# Altium schematic sheet 2022 PD Board.SchDoc
size 254 x 381 mm
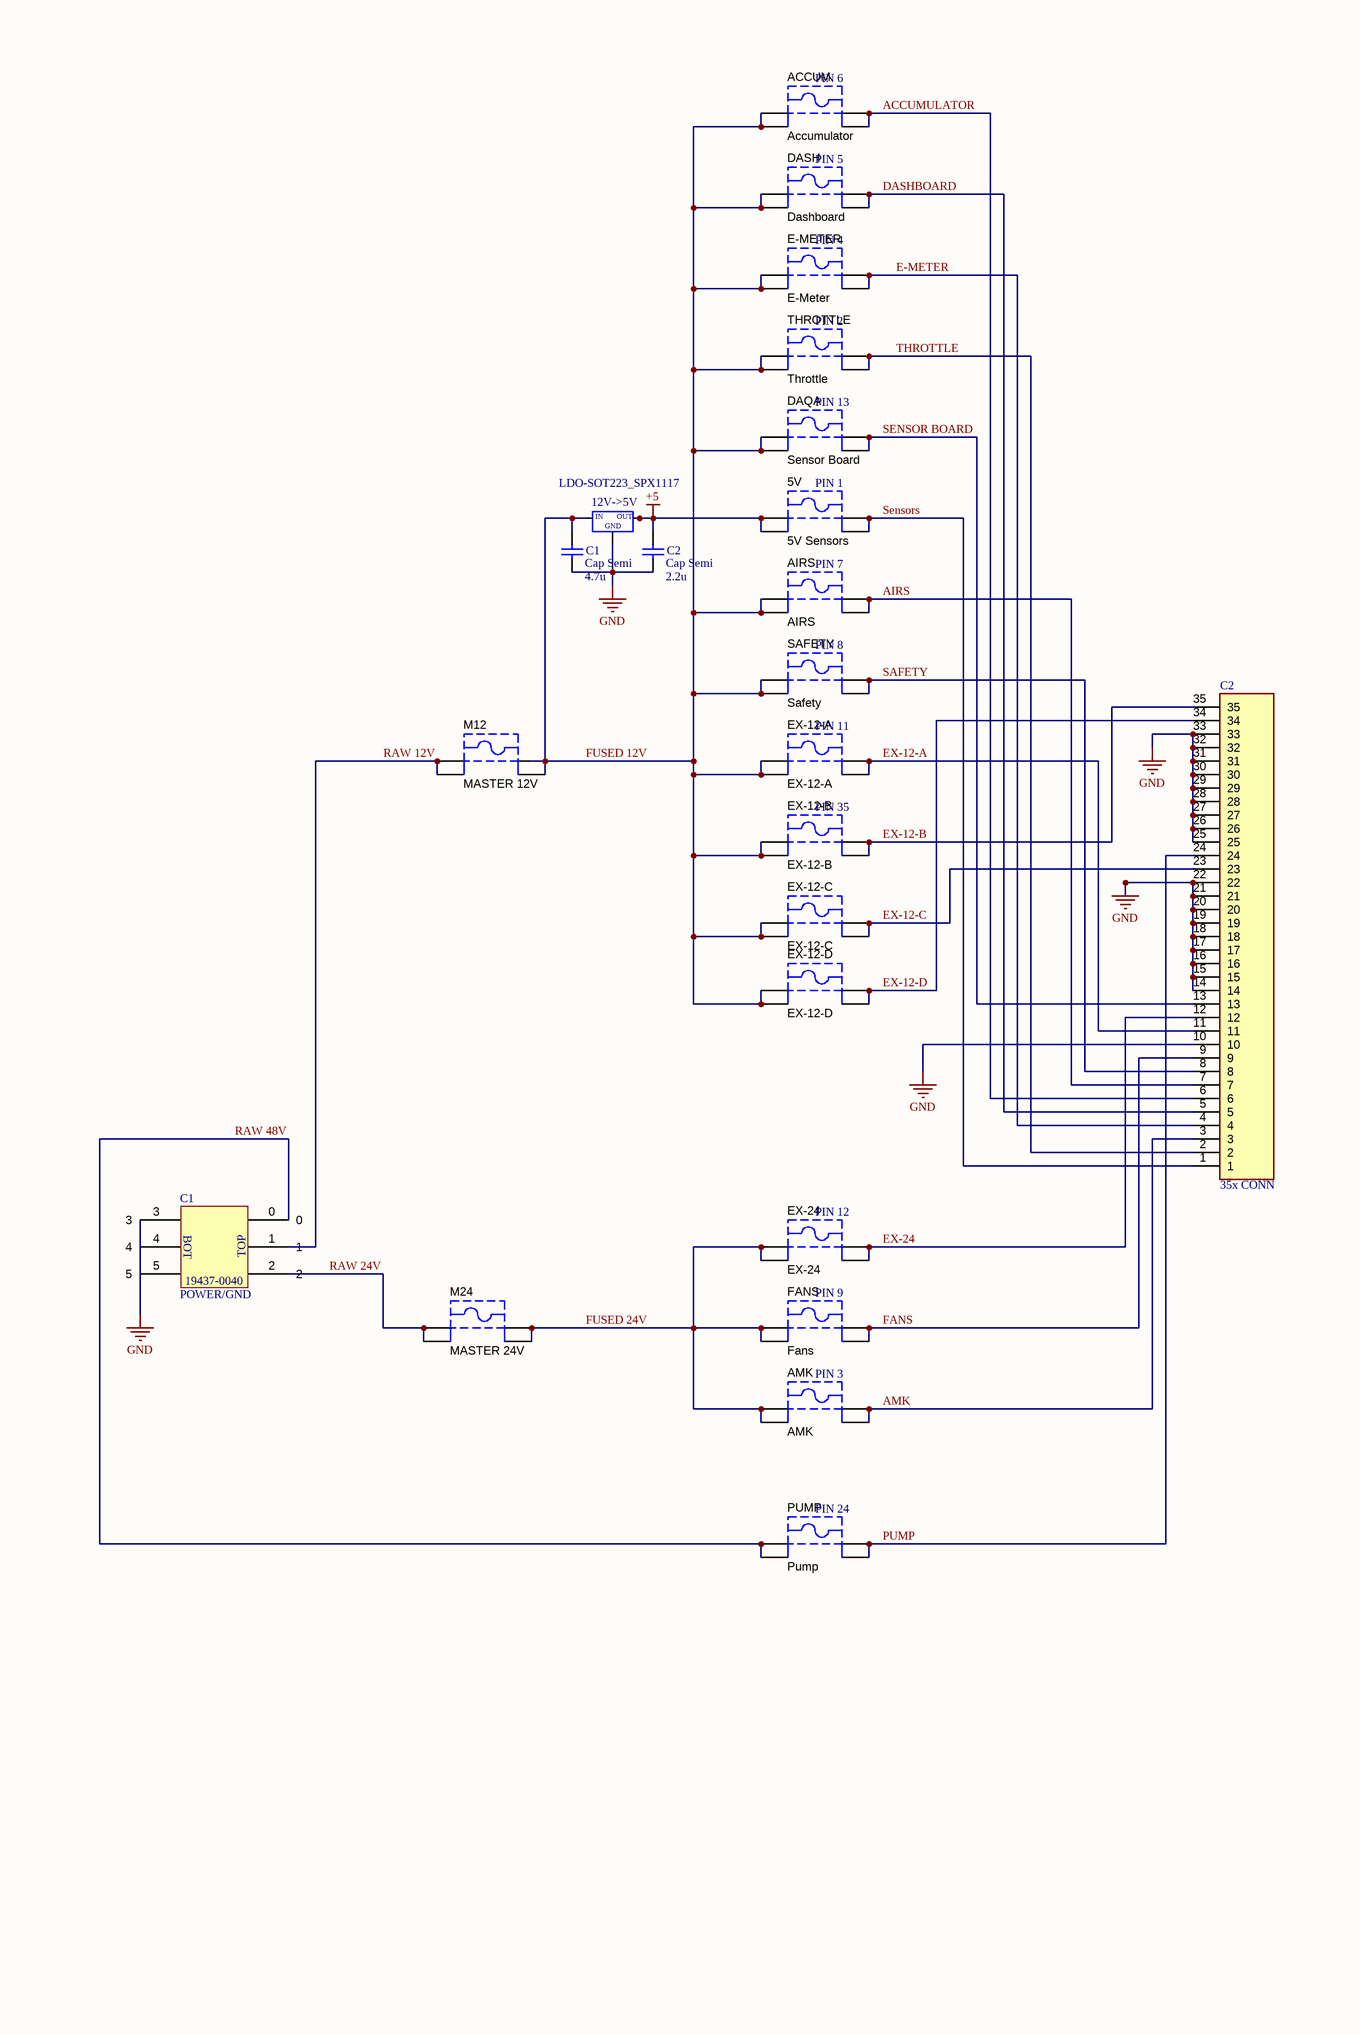
[diagram p0: 2022 PD Board.SchDoc]

## Parts
(Parts that share a designator on the sheet are numbered #1, #2 ... from top to bottom, then left to right.)
5V  5V Sensors  [KSTN-3568_V]
12V->5V  LDO-SOT223_SPX1117  [SOT223]
ACCUM  Accumulator  [KSTN-3568_V]
AIRS  AIRS  [KSTN-3568_V]
AMK  AMK  [KSTN-3568_V]
C1#1  Cap Semi  value 4.7u  [C1206]
C1#2  POWER/GND  [19437-0040-Footprint-1]
C2#1  Cap Semi  value 2.2u  [C1206]
C2#2  35x CONN  [TE_776163-5]
DAQA  Sensor Board  [KSTN-3568_V]
DASH  Dashboard  [KSTN-3568_V]
E-METER  E-Meter  [KSTN-3568_V]
EX-12-A  EX-12-A  [KSTN-3568_V]
EX-12-B  EX-12-B  [KSTN-3568_V]
EX-12-C  EX-12-C  [KSTN-3568_V]
EX-12-D  EX-12-D  [KSTN-3568_V]
EX-24  EX-24  [KSTN-3568_V]
FANS  Fans  [KSTN-3568_V]
M12  MASTER 12V  [KSTN-3568_V]
M24  MASTER 24V  [KSTN-3568_V]
PUMP  Pump  [KSTN-3568_V]
SAFETY  Safety  [KSTN-3568_V]
THROTTLE  Throttle  [KSTN-3568_V]

## Nets
+5: 5V.1 5V.2 12V->5V.2 12V->5V.4 C2#1.1
GND: 12V->5V.1 C1#1.2 C2#1.2 C2#2.10 C2#2.14 C2#2.15 C2#2.16 C2#2.17 C2#2.18 C2#2.19 C2#2.20 C2#2.21 C2#2.22 C2#2.25 C2#2.26 C2#2.27 C2#2.28 C2#2.29 C2#2.30 C2#2.31 C2#2.32 C2#2.33
ACCUMULATOR: ACCUM.3 ACCUM.4 C2#2.6
AIRS: AIRS.3 AIRS.4 C2#2.7
AMK: AMK.3 AMK.4 C2#2.3
DASHBOARD: C2#2.5 DASH.3 DASH.4
E-METER: C2#2.4 E-METER.3 E-METER.4
EX-12-A: C2#2.11 EX-12-A.3 EX-12-A.4
EX-12-B: C2#2.35 EX-12-B.3 EX-12-B.4
EX-12-C: C2#2.23 EX-12-C.3 EX-12-C.4
EX-12-D: C2#2.34 EX-12-D.3 EX-12-D.4
EX-24: C2#2.12 EX-24.3 EX-24.4
FANS: C2#2.9 FANS.3 FANS.4
FUSED 12V: 12V->5V.3 ACCUM.1 ACCUM.2 AIRS.1 AIRS.2 C1#1.1 DAQA.1 DAQA.2 DASH.1 DASH.2 E-METER.1 E-METER.2 EX-12-A.1 EX-12-A.2 EX-12-B.1 EX-12-B.2 EX-12-C.1 EX-12-C.2 EX-12-D.1 EX-12-D.2 M12.3 M12.4 SAFETY.1 SAFETY.2 THROTTLE.1 THROTTLE.2
FUSED 24V: AMK.1 AMK.2 EX-24.1 EX-24.2 FANS.1 FANS.2 M24.3 M24.4
PUMP: C2#2.24 PUMP.3 PUMP.4
RAW 12V: M12.1 M12.2
RAW 24V: M24.1 M24.2
RAW 48V: PUMP.1 PUMP.2
SAFETY: C2#2.8 SAFETY.3 SAFETY.4
SENSOR BOARD: C2#2.13 DAQA.3 DAQA.4
Sensors: 5V.3 5V.4 C2#2.1
THROTTLE: C2#2.2 THROTTLE.3 THROTTLE.4

Not connected (* = marked no-connect by the designer): C1#2 0 1 2 3 4 5

## Notes on the sheet
- (near ACCUM) PIN 6
- PIN 5
- PIN 4
- PIN 2
- PIN 13
- PIN 1
- PIN 7
- PIN 8
- PIN 11
- PIN 35
- (near EX-24) PIN 12
- PIN 9
- PIN 3
- (near PUMP) PIN 24
- DWG. NO.
- REV.
- SHT.
- THIS DOCUMENT AND THE DATA DISCLOSED HEREIN OR HEREWITH IS THE PROPERTY OF ALTIUM LIMITED AND MAY BE FREELY DISTRIBUTED IN WHOLE. NO RIGHTS ARE RESERVED OR EXPRESS OR IMPLIED WARANTEE GIVEN.
- REVISION
- DESCRIPTION
- DATE
- APPROVED
- ENG:
- APPROVALS
- PROJECT
- DSN:
- CHK:
- REFERENCE DOCUMENTS
- PROJECT REVISION:
- TITLE
- DOCUMENT REVISION:
- DESIGN ITEM:
- BOM:
- FAB DWG:
- PCB DWG:
- ASSY DWG:
- SCALE:
- SIZE
- B
- CAGE CODE
- FILE NAME
- DWG NO.
- SHEET
- OF
- REV
- (in symbol 19437-0040) BOT; TOP
- (in symbol CMP-009-000254-1) IN; OUT; GND

## Library data of the parts
5V ACCUM AIRS AMK DAQA DASH E-METER EX-12-A EX-12-B EX-12-C EX-12-D EX-24 FANS M12 M24 PUMP SAFETY THROTTLE = CMP-2000-05464-1: Fuse Holder, 20 A, 500 V, -50 to 145 degC, 4-Pin THD, RoHS; Manufacturer: Keystone; Package Reference: 3568; Datasheet Version: 04/2013; Datasheet URL: https://datasheet.ciiva.com/16294/m60-2p40-16294706.pdf; Manufacturer URL: http://www.keyelco.com/; Mounting Technology: ThroughHole; Package Description: 4-Pin Through Hole Device, Body 16 x 6.73 mm, Pitch 9.9 mm
12V->5V = CMP-009-000254-1: Design Item ID: LDO-SOT223_SPX1117; Source: ife19_Elec_Library.schlib
C1#1 C2#1 = Cap Semi: Capacitor (Semiconductor SIM Model); Published: 8-Jun-2000; LatestRevisionDate: 29-May-2009; LatestRevisionNote: IPC-7351 Footprint Added.; PackageReference: C1206; Publisher: Altium Limited; PackageDescription: Chip Capacitor
C1#2 = 19437-0040: ComponentLink1Description: New link; ComponentLink1URL: https://www.mouser.com/ProductDetail/Molex/19437-0040?qs=IvjI65BR3TWbILBHf7ByJQ%3D%3D
C2#2 = 776163-5: Conn Power HDR 23 POS 4mm Solder RA Thru-Hole 23 Terminal 1 Port Automotive; MF: {'manufacturer': 'TE Connectivity'}; Value: *; MP: 776163-5; Package: None; Availability: Unavailable; Price: None